# EAGLE design batteryboard (EAGLE 5.06)
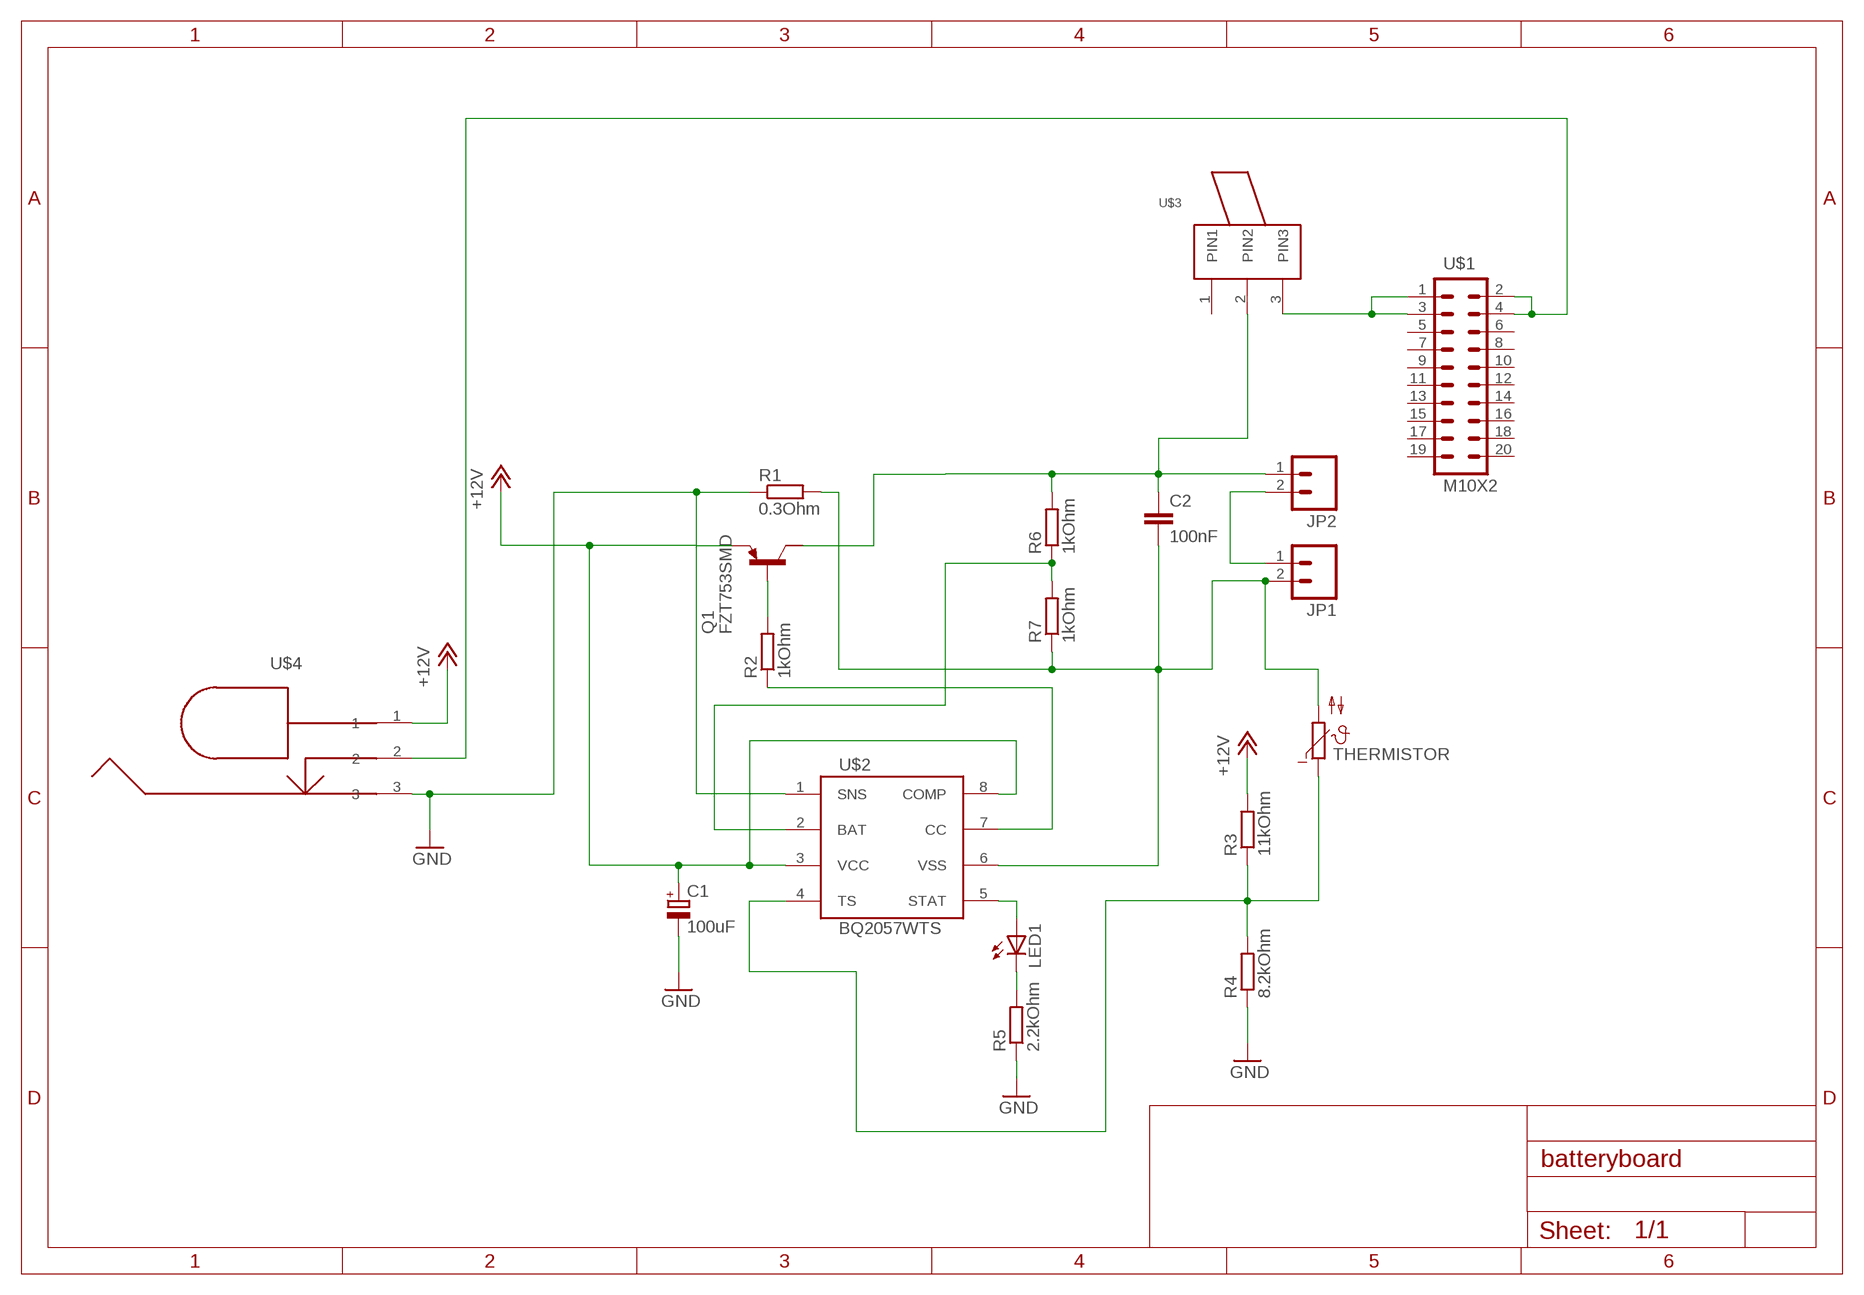
[diagram p0: schematic, sheet 1]

## Parts
C1  100uF  CPOL-EUD  [PANASONIC_D]
C2  100nF  C-EUC0805  [C0805]
JP1  M02-JST-2MM-SMT  [S2B-PH]
JP2  M02-JST-2MM-SMT  [S2B-PH]
LED1  LEDCHIPLED_0805  [CHIPLED_0805]
Q1  FZT753SMD  [SOT223]
R1  0.3Ohm  R-EU_R0805  [R0805]
R2  1kOhm  R-EU_R0805  [R0805]
R3  11kOhm  R-EU_R0805  [R0805]
R4  8.2kOhm  R-EU_R0805  [R0805]
R5  2.2kOhm  R-EU_R0805  [R0805]
R6  1kOhm  R-EU_R0805  [R0805]
R7  1kOhm  R-EU_R0805  [R0805]
THERMISTOR  NTC640  [P640]
U$1  M10X2  [2X10]
U$2  BQ2057WTS  [SSOP-8]
U$3  SWITCH  [SWITCH]
U$4  LUMBERG-RC5320A  [POWERPLUG]

## Nets
+12V: C1.+ Q1.3(E) R3.2 U$2.3(VCC) U$2.8(COMP) U$4.1
GND: C1.- R1.1 R4.1 R5.1 U$2.1(SNS) U$4.3
N$1: U$1.1 U$1.3 U$3.3(PIN3)
N$2: U$1.2 U$1.4 U$4.2
N$3: Q1.1(B) R2.2
N$4: R2.1 U$2.7(CC)
N$5: R3.1 R4.2 THERMISTOR.1 U$2.4(TS)
N$6: JP1.1 JP2.2
N$7: C2.1 JP2.1 Q1.2(C) R6.2 U$3.2(PIN2)
N$8: C2.2 JP1.2 R1.2 R7.1 THERMISTOR.2 U$2.6(VSS)
N$9: LED1.A U$2.5(STAT)
N$10: LED1.C R5.2
N$11: R6.1 R7.2 U$2.2(BAT)
Unconnected: Q1.4(C/) U$1.5 U$1.6 U$1.7 U$1.8 U$1.9 U$1.10 U$1.11 U$1.12 U$1.13 U$1.14 U$1.15 U$1.16 U$1.17 U$1.18 U$1.19 U$1.20 U$3.1(PIN1)

## Library data of the parts
C1 = resistor:CPOL-EU: POLARIZED CAPACITOR, European symbol
C2 = resistor:C-EU: CAPACITOR, European symbol
JP1 JP2 = sparkfun-v2.0:M02: Header 2 Standard 2-pin 0.1" header. Use with straight break away headers (SKU : PRT-00116), right angle break away headers (PRT-00553), swiss pins (PRT-00743), machine pins (PRT-00117), and female headers (PRT-00115). Molex polarized connector foot print use with SKU : PRT-08233 with associated crimp pins and housings.
LED1 = led:LED: LED OSRAM: - CHIPLED LG R971, LG N971, LY N971, LG Q971, LY Q971, LO R971, LY R971 LH N974, LH R974 LS Q976, LO Q976, LY Q976 LO Q996 - Hyper CHIPLED LW Q18S LB Q993, LB Q99A, LB R99A - SideLED LS A670, LO A670, LY A670, LG A670, LP A670 LB A673, LV A673, LT A673, LW A673 LH A674 LY A675 LS A676, LA A676, LO A676, LY A676, LW A676 LS A679, LY A679, LG A679 - Hyper Micro SIDELED® LS Y876, LA Y876, LO Y876, LY Y876 LT Y87S - SmartLED LW L88C, LW L88S LB L89C, LB L89S, LG L890 LS L89K, LO L89K, LY L89K LS L896, LA L896, LO L896, LY L896 - TOPLED LS T670, LO T670, LY T670, LG T670, LP T670 LSG T670, LSP T670, LSY T670, LOP T670, LYG T670 LG T671, LOG T671, LSG T671 LB T673, LV T673, LT T673, LW T673 LH T674 LS T676, LA T676, LO T676, LY T676, LB T676, LH T676, LSB T676, LW T676 LB T67C, LV T67C, LT T67C, LS T67K, LO T67K, LY T67K, LW E67C LS E67B, LA E67B, LO E67B, LY E67B, LB E67C, LV E67C, LT E67C LW T67C LS T679, LY T679, LG T679 LS T770, LO T770, LY T770, LG T770, LP T770 LB T773, LV T773, LT T773, LW T773 LH T774 LS E675, LA E675, LY E675, LS T675 LS T776, LA T776, LO T776, LY T776, LB T776 LHGB T686 LT T68C, LB T68C - Hyper Mini TOPLED® LB M676 - Mini TOPLED Santana® LG M470 LS M47K, LO M47K, LY M47K Source: http://www.osram.convergy.de LUXEON: - LUMILED® LXK2-PW12-R00, LXK2-PW12-S00, LXK2-PW14-U00, LXK2-PW14-V00 LXK2-PM12-R00, LXK2-PM12-S00, LXK2-PM14-U00 LXK2-PE12-Q00, LXK2-PE12-R00, LXK2-PE12-S00, LXK2-PE14-T00, LXK2-PE14-U00 LXK2-PB12-K00, LXK2-PB12-L00, LXK2-PB12-M00, LXK2-PB14-N00, LXK2-PB14-P00, LXK2-PB14-Q00 LXK2-PR12-L00, LXK2-PR12-M00, LXK2-PR14-Q00, LXK2-PR14-R00 LXK2-PD12-Q00, LXK2-PD12-R00, LXK2-PD12-S00 LXK2-PH12-R00, LXK2-PH12-S00 LXK2-PL12-P00, LXK2-PL12-Q00, LXK2-PL12-R00 Source: www.luxeon.com KINGBRIGHT: KA-3528ASYC Source: www.kingbright.com
Q1 = transistor-pnp:FZT753SMD: PNP Transistor
R1-R7 = resistor:R-EU_: RESISTOR, European symbol
THERMISTOR = ptc-ntc:NTC640: PHILIPS NTC
U$1 = sparkfun-v2.0:M10X2: This was SPECIALLY designed to be used with our Graphic LCD Backpack. Be sure you want to use this! It is not only staggered on each line of header holes, but IT IS ALSO offset of the center point of the top and bottom lines by 5 mil. This causes the headers to lock into place on the "standard" footprint on the LCD screen. The extra squares on the tdocu layer are there simply to reference other pins (if you were to actually populate a longer header than ten long - this is what we do with the backpacks).
U$2 = jmk-lib:BQ2057WTS
U$3 = jmk-lib:SWITCH: Switch on-off-on
U$4 = jmk-lib:LUMBERG-RC5320A

## Board
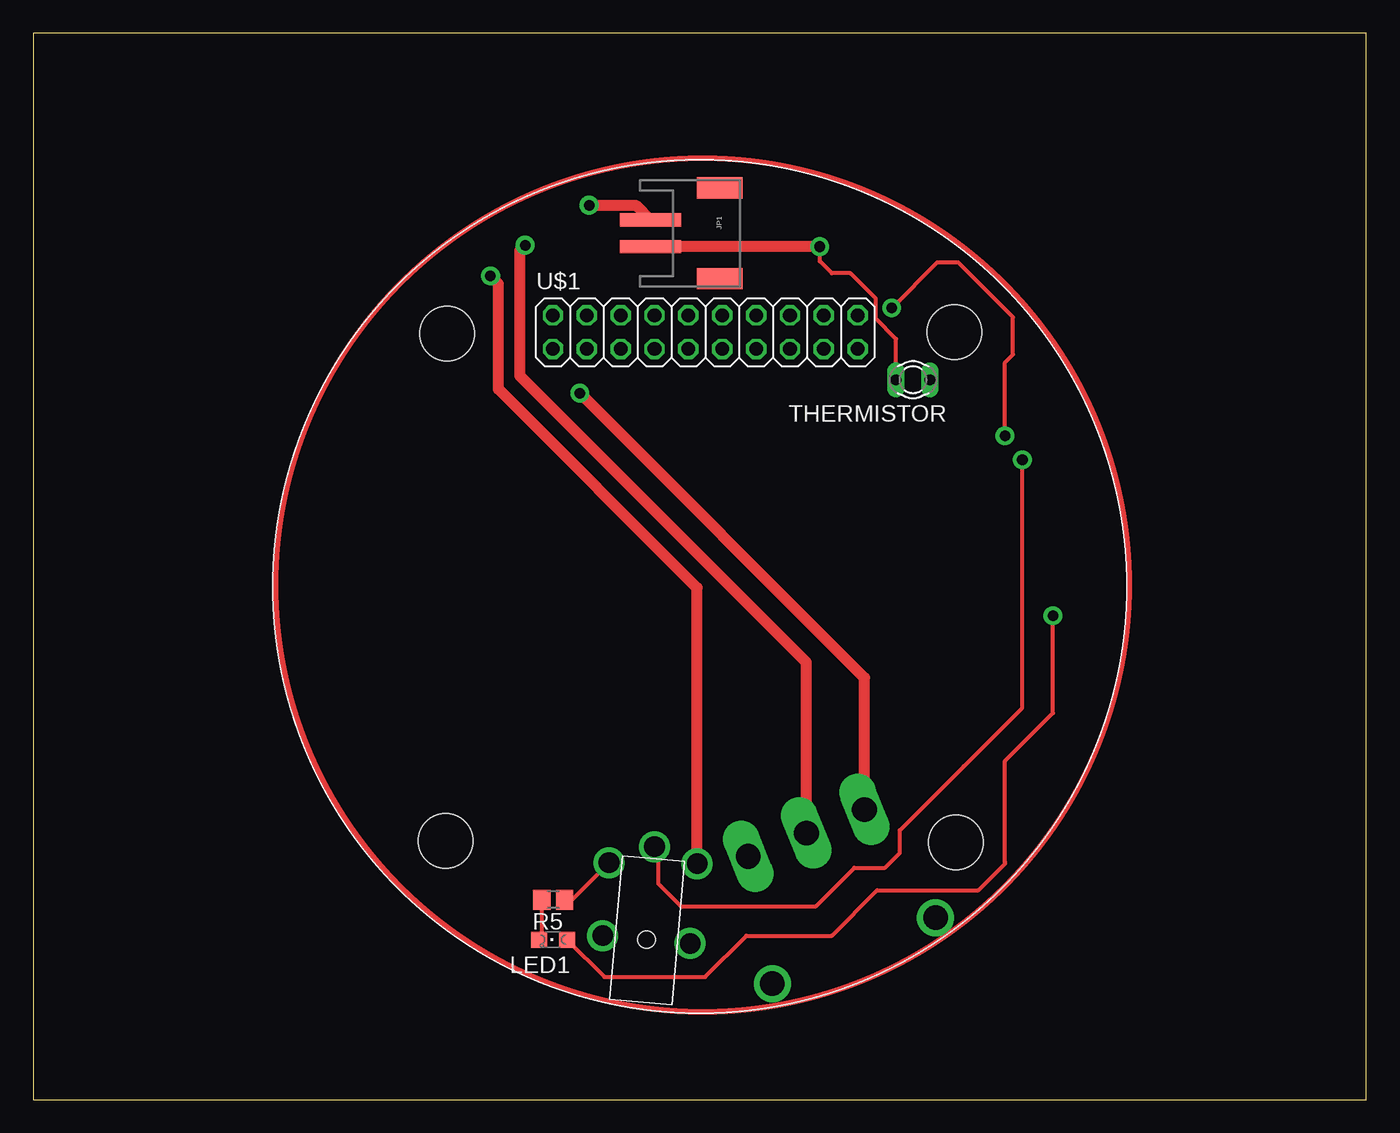
[diagram p1: board, top side]
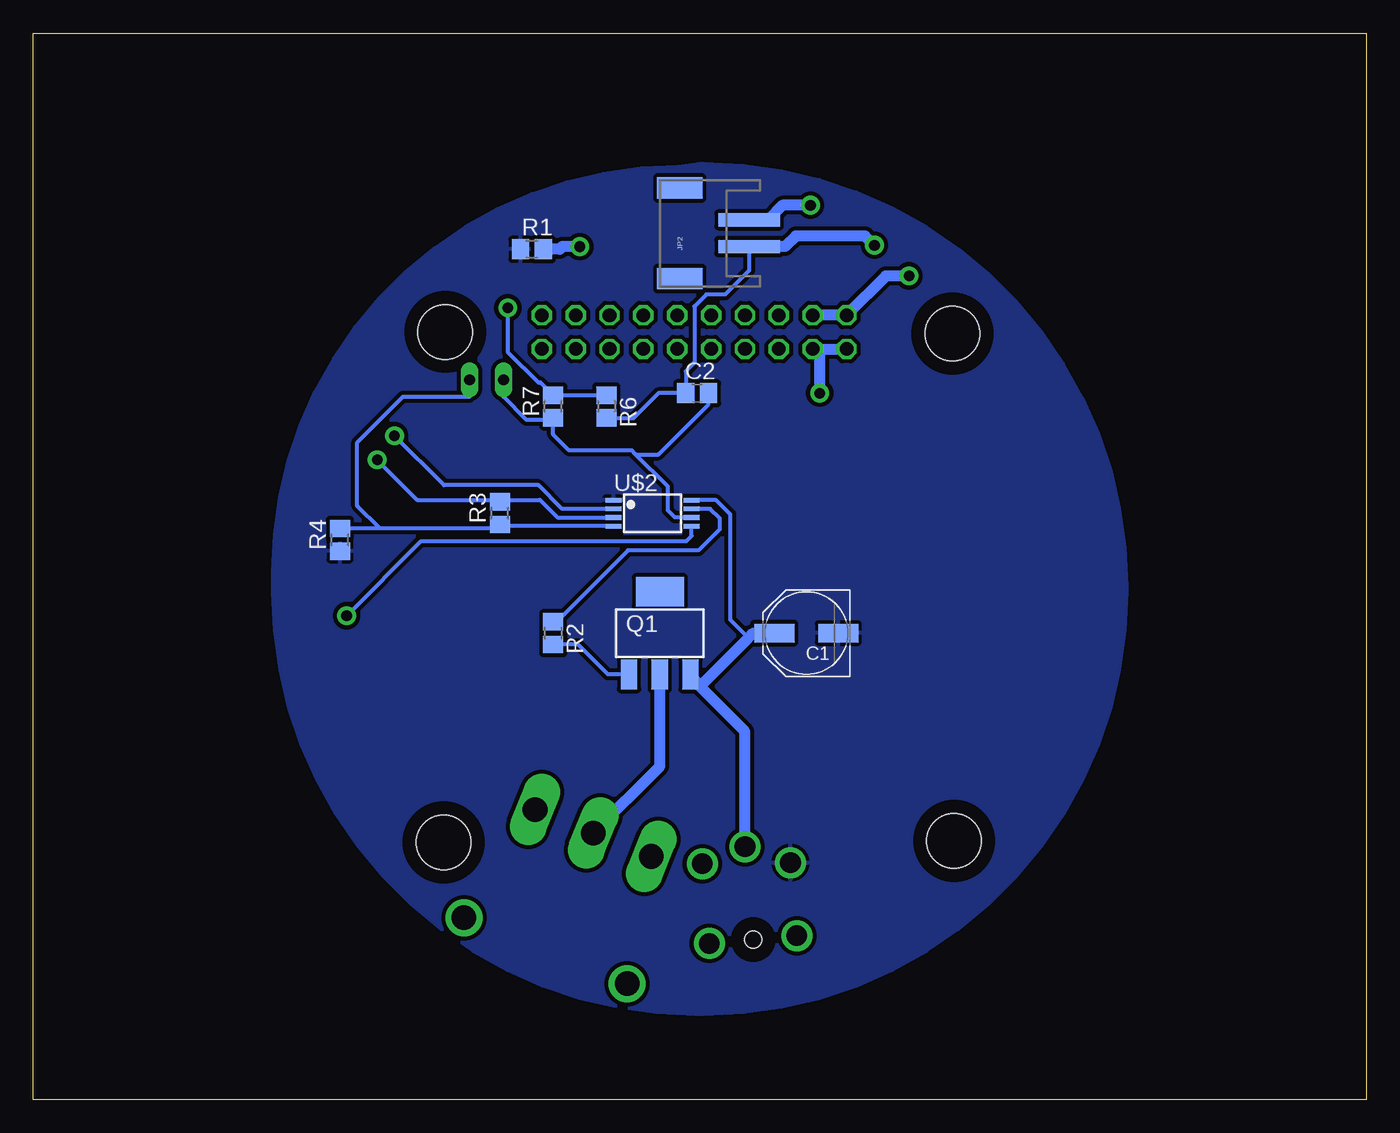
[diagram p2: board, bottom side, seen from below]

Size 100 x 80 mm. Coordinates in mm from the lower left corner, seen from the top.
Outline: 0,0 100,0 100,80 0,80 0,0
Copper layers (1*16): Top 0.035mm / dielectric 1.5mm / Bottom 0.035mm
Design rules "default *": minimum track width 10mil, minimum drill 0.6mm, track to track 12mil, track to pad 12mil, pad to pad 12mil, via to via 12mil, smd to smd 8mil, copper to edge 40mil, drill to drill 8mil, minimum pad ring 10mil, minimum via ring 8mil, stop-mask expansion 4mil, vias tented up to drill 0mil, thermal gap 10mil

### Footprints (pad centres in the part's own frame; a part is rotated, then mirrored left to right if it is on the bottom)
PANASONIC_D = smd 3 x 1.4: + 2.4,0; - -2.4,0
C0805 = smd 1.3 x 1.5: 1 -0.85,0; 2 0.85,0
S2B-PH = smd 1 x 4.6: 1 -1,-3.7; 2 1,-3.7 | smd 1.6 x 3.4: NC1 -3.4,1.5; NC2 3.4,1.5
CHIPLED_0805 = smd 1.2 x 1.2: A 0,-1.05; C 0,1.05
SOT223 = smd 1.219 x 2.235: 1 -2.311,-3.099; 2 0,-3.099; 3 2.311,-3.099 | smd 3.6 x 2.2: 4 0,3.099
R0805 = smd 1.3 x 1.5: 1 -0.85,0; 2 0.85,0
P640 = drill 0.813 long: 1 -1.27,0; 2 1.27,0
2X10 = drill 1.016 octagon: 1 -11.013,-7.687; 2 -11.013,-5.147; 3 -8.473,-7.687; 4 -8.473,-5.147; 5 -5.933,-7.687; 6 -5.933,-5.147; 7 -3.393,-7.687; 8 -3.393,-5.147; 9 -0.853,-7.687; 10 -0.853,-5.147; 11 1.687,-7.687; 12 1.687,-5.147; 13 4.227,-7.687; 14 4.227,-5.147; 15 6.767,-7.687; 16 6.767,-5.147; 17 9.307,-7.687; 18 9.307,-5.147; 19 11.847,-7.687; 20 11.847,-5.147 | hole 4.1: 19.093,-6.407; 19.22,-44.715; -19.087,-44.591; -18.964,-6.533
SSOP-8 = smd 1.2 x 0.35: 1 -5.465,0.975; 2 -5.465,0.325; 3 -5.465,-0.325; 4 -5.465,-0.975; 5 0.385,-0.975; 6 0.385,-0.325; 7 0.385,0.325; 8 0.385,0.975
SWITCH = drill 1.85 long: 1 -4.7,0; 2 0,0; 3 4.7,0 | drill 1.85 round: P$1 6.605,-9.53; P$3 -6.605,-9.53
POWERPLUG = drill 1.55 round: 1 7,0; 2 6,-3.3; 3 5.5,3.3; NC1 0,3.3; NC2 0,-3.3 | hole 1.3: 0,0

### Placement (x,y rotation side)
C1  42,35 180 bottom
C2  50.2,53 0 bottom
JP1  50,65 270 top
JP2  50,65 90 bottom
LED1  39,12 90 top
Q1  53,35 0 bottom
R1  62.6,63.8 0 bottom
R2  61,35 270 bottom
R3  65,44 90 bottom
R4  77,42 90 bottom
R5  39,15 180 top
R6  57,52 270 bottom
R7  61,52 90 bottom
THERMISTOR  66,54 180 top
U$1  50,64 0 top
U$2  51,44 0 bottom
U$3  58,20 22 top
U$4  46,12 85 top

### Tracks (layer width: path | path; a pad name or v marks a point on that pad's centre or on a via)
+12V  (via drill 0.8 pad 1.42)
  Top 0.305: v74.2,48 74.2,29.4 69.8,25 65,20.2 65,18.5 63.9,17.4 61.6,17.4 58.7,14.5 48.6,14.5 46.9,16.2 46.9,18.68 U$4.1
  Bottom 0.305: U$2.3 60.67,43.67 62,45 64.85,45 | 64.85,45 R3.2 64.85,45 | U$2.8 48.77,44.98 47.7,43.9 47.7,36 46.35,34.65 | 64.85,45 71.2,45 v74.2,48
  Bottom 0.813: 50,31 47,28 46.61,27.61 U$4.1 | 50,31 Q1.3 | C1.+ 46,35 46.35,34.65 50,31
GND
  Top 0.305: R5.1 40.42,15 U$4.3
  pour Bottom: 48.9,6.6 49.1,6.6 arc90
  pour Bottom: 50,70.2 49.7,70.2 arc90 18,38.5 18,38.1 arc90 49.7,6.4 50.3,6.4 arc90 82,38.1 82,39.6 arc90 51.6,70
N$1  (via drill 0.8 pad 1.42)
  Top 0.813: U$3.3 62.36,31.64 v41,53
  Bottom 0.813: v41,53 41,55.78 U$1.3 U$1.1
N$2  (via drill 0.8 pad 1.42)
  Top 0.813: U$4.2 49.81,38.39 34.9,53.3 34.9,61.2 v34.3,61.8
  Bottom 0.813: v34.3,61.8 36.04,61.8 U$1.2 U$1.4
N$3
  Bottom 0.305: R2.2 59.15,34.15 56.9,31.9 Q1.1
N$4
  Bottom 0.305: R2.1 60.75,35.85 55.4,41.2 50.1,41.2 48.5,42.8 48.5,43.6 49.23,44.33 U$2.7
N$5
  Bottom 0.305: THERMISTOR.1 67.27,52.73 72.27,52.73 75.7,49.3 75.7,44.55 74,42.85 | U$2.4 64.88,43.02 R3.1 65.3,42.85 66,42.85 74,42.85 | 74,42.85 R4.2
N$6  (via drill 0.8 pad 1.42)
  Top 0.813: v41.7,67.1 45.2,67.1 JP1.1
  Bottom 0.813: JP1.1 44.9,66 43.8,67.1 v41.7,67.1
N$7  (via drill 0.8 pad 1.42)
  Top 0.813: U$3.2 58,32.8 36.5,54.3 36.5,63.7 v36.9,64.1
  Bottom 0.305: JP2.1 46.3,62.2 48.1,60.4 49.5,60.4 50.4,59.5 50.4,55.3 51.05,54.65 C2.1 53.1,53 55,51.1 56.95,51.1 R6.2
  Bottom 0.813: v36.9,64.1 37.6,64.8 42.8,64.8 43.6,64 43.8,64 JP2.1 | Q1.2 53,25 U$3.2
N$8  (via drill 0.8 pad 1.42)
  Top 0.305: THERMISTOR.2 64.73,57.07 63.2,58.6 63.2,60.1 61.3,62 59.9,62 59,62.9 v59,64
  Top 0.813: v59,64 JP1.2
  Bottom 0.305: THERMISTOR.2 64.73,52.73 63,51 61.15,51 R7.1 61,49.9 59.8,48.7 55.1,48.7 54.85,48.45 | 54.85,48.45 52.4,46 52.4,44.2 51.88,43.67 U$2.6 50.64,43.7 | C2.2 49.35,52.15 53.1,48.4 54.8,48.4 54.85,48.45
  Bottom 0.813: v59,64 60.3,64 60.5,63.8 R1.2
N$9  (via drill 0.8 pad 1.42)
  Top 0.305: v76.5,36.3 76.5,29 72.9,25.4 72.9,17.8 72.9,17.7 70.9,15.7 63.3,15.7 59.9,12.3 53.5,12.3 50.4,9.2 42.85,9.2 LED1.A
  Bottom 0.305: U$2.5 50.62,42.28 51,41.9 70.9,41.9 v76.5,36.3
N$10
  Top 0.305: R5.2 38.15,12.2 LED1.C
N$11  (via drill 0.8 pad 1.42)
  Top 0.305: v72.9,49.8 72.9,55.3 73.5,55.9 73.5,58.7 69.4,62.8 67.8,62.8 v64.4,59.4
  Bottom 0.305: R6.1 R7.2 61.95,53.8 62.1,53.8 64.4,56.1 v64.4,59.4 | U$2.2 60.33,44.33 62.1,46.1 69.2,46.1 v72.9,49.8
(copper drawn outside any net)
  shapes: Top circle x1